# EAGLE design BUZZI-25 (EAGLE 4.15)
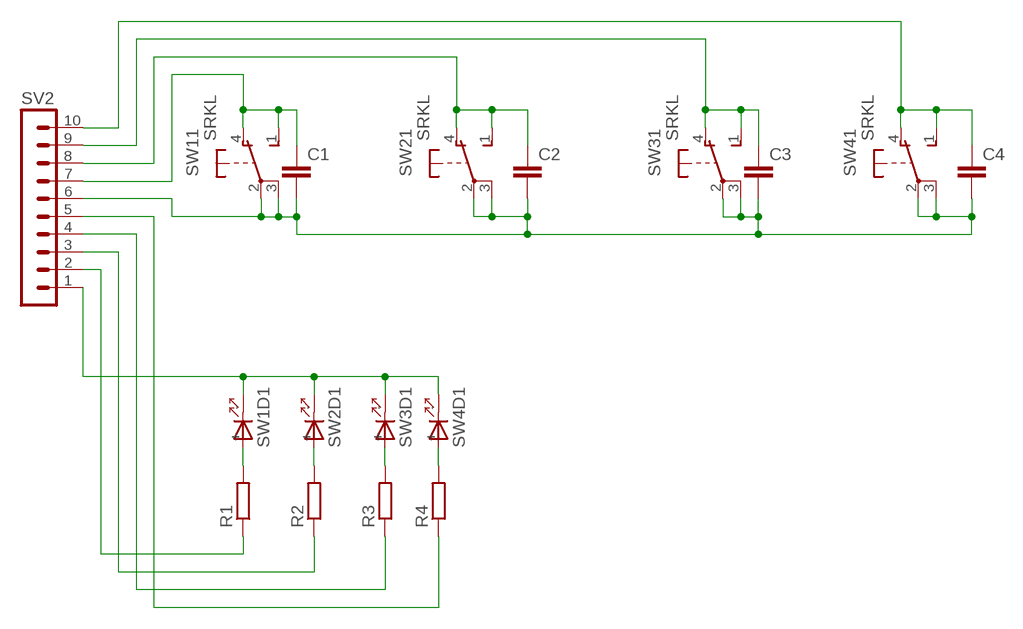
[diagram p0: schematic, sheet 1]

## Parts
C1  C-EUC0805  [C0805]
C2  C-EUC0805  [C0805]
C3  C-EUC0805  [C0805]
C4  C-EUC0805  [C0805]
R1  R-EU_M0805  [M0805]
R2  R-EU_M0805  [M0805]
R3  R-EU_M0805  [M0805]
R4  R-EU_M0805  [M0805]
SV2  MA10-1  [MA10-1]
SW1  SRKL  [SRKL]
SW2  SRKL  [SRKL]
SW3  SRKL  [SRKL]
SW4  SRKL  [SRKL]

## Nets
N$1: R1.2 SW1.+(D1:A)
N$2: R2.2 SW2.+(D1:A)
N$3: R3.2 SW3.+(D1:A)
N$4: R4.2 SW4.+(D1:A)
N$5: SV2.1 SW1.-(D1:C) SW2.-(D1:C) SW3.-(D1:C) SW4.-(D1:C)
N$6: R1.1 SV2.2
N$7: R2.1 SV2.3
N$8: R3.1 SV2.4
N$9: R4.1 SV2.5
N$10: C1.1 SV2.7 SW1.1(1:S) SW1.4(1:O)
N$11: C1.2 C2.2 C3.2 C4.2 SV2.6 SW1.2(1:P) SW1.3(1:P) SW2.2(1:P) SW2.3(1:P) SW3.2(1:P) SW3.3(1:P) SW4.2(1:P) SW4.3(1:P)
N$12: C2.1 SV2.8 SW2.1(1:S) SW2.4(1:O)
N$14: C3.1 SV2.9 SW3.1(1:S) SW3.4(1:O)
N$16: C4.1 SV2.10 SW4.1(1:S) SW4.4(1:O)

## Library data of the parts
C1-C4 = rcl:C-EU: CAPACITOR, European symbol
R1-R4 = rcl:R-EU_: RESISTOR, European symbol
SV2 = con-lstb:MA10-1: PIN HEADER
SW1-SW4 = switch-misc:SRKL: SWITCH

## Board
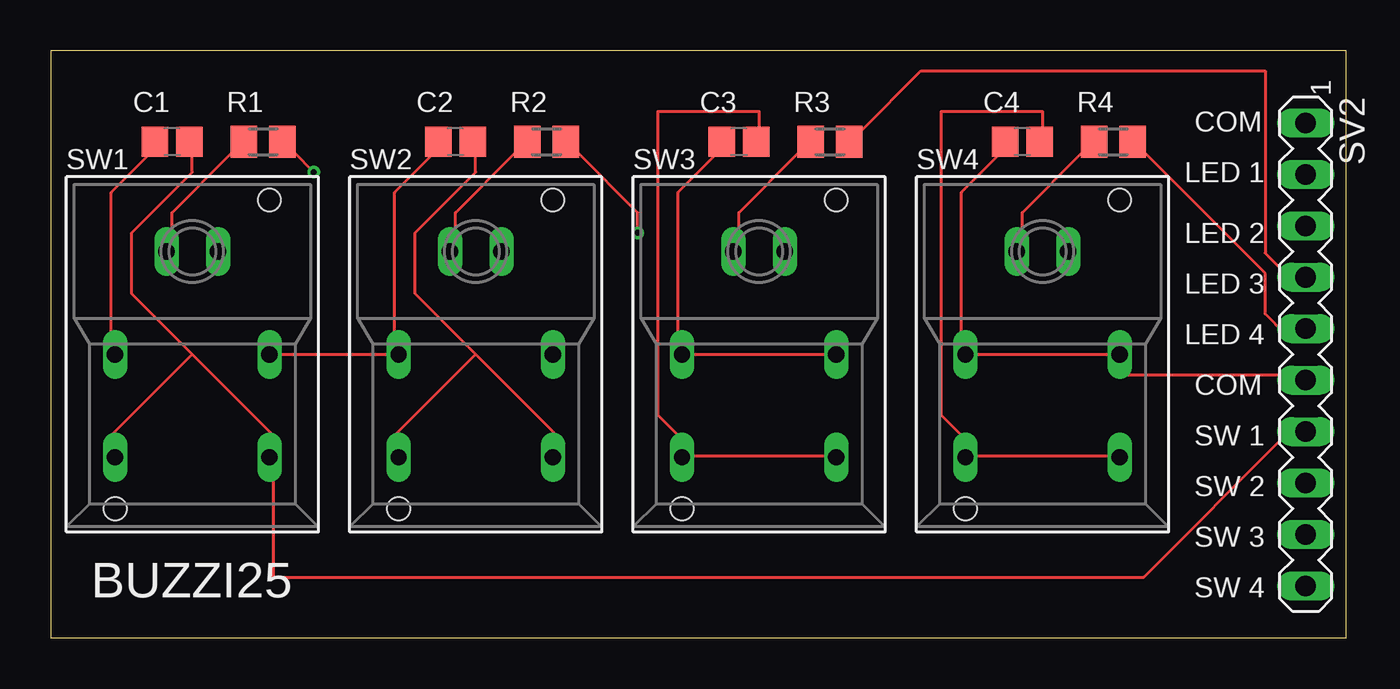
[diagram p1: board, top side]
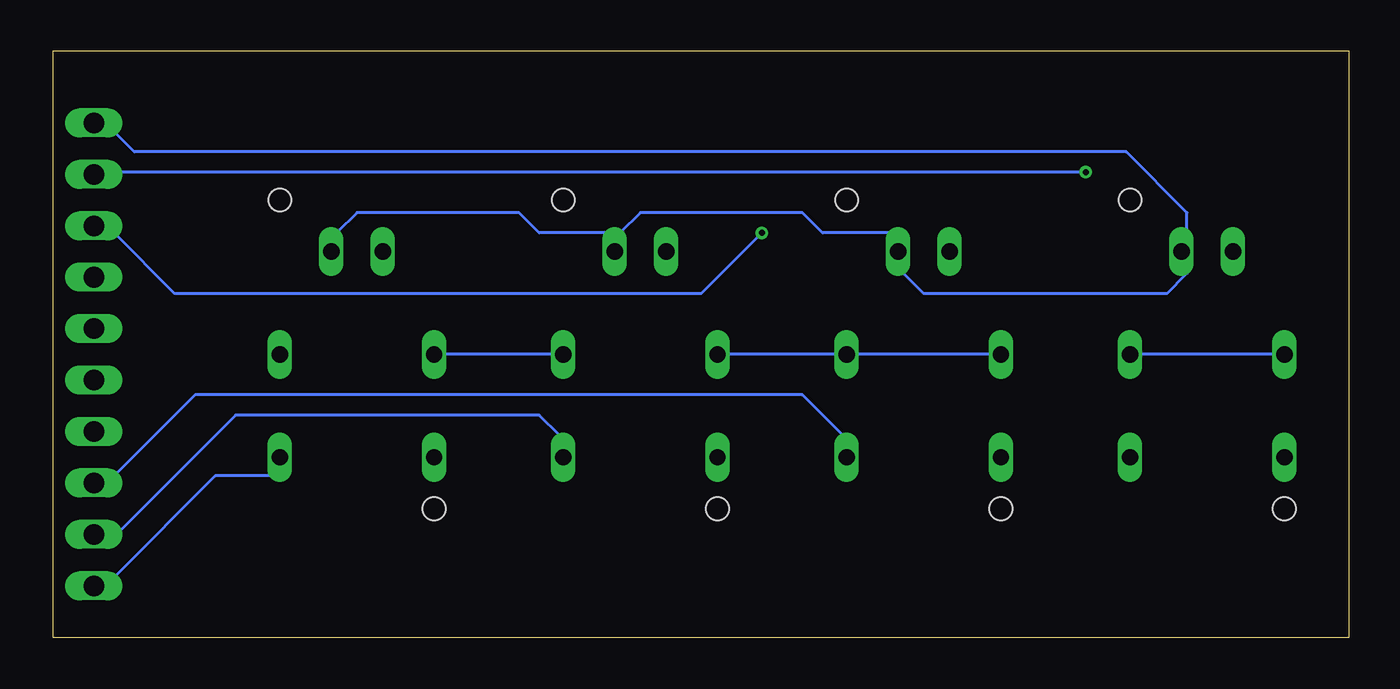
[diagram p2: board, bottom side, seen from below]

Size 64 x 29 mm. Coordinates in mm from the lower left corner, seen from the top.
Outline: 0,0 64,0 64,29 0,29 0,0
Copper layers (1*16): Top 0.035mm / dielectric 1.5mm / Bottom 0.035mm
Design rules "PCB-POOL": minimum track width 6mil, minimum drill 12mil, track to track 6mil, track to pad 6mil, pad to pad 6mil, via to via 6mil, smd to smd 6mil, copper to edge 20mil, drill to drill 8mil, minimum pad ring 8mil, minimum via ring 6mil, stop-mask expansion 3mil, vias tented up to drill 0mil, thermal gap 8mil

### Footprints (pad centres in the part's own frame; a part is rotated, then mirrored left to right if it is on the bottom)
C0805 = smd 1.3 x 1.5: 1 -0.85,0; 2 0.85,0
M0805 = smd 1.3 x 1.6: 1 -0.95,0; 2 0.95,0
MA10-1 = drill 1.016 long: 1 -11.43,0; 2 -8.89,0; 3 -6.35,0; 4 -3.81,0; 5 -1.27,0; 6 1.27,0; 7 3.81,0; 8 6.35,0; 9 8.89,0; 10 11.43,0
SRKL = drill 0.813 long: 1 -3.81,-5.08; 2 -3.81,0; 3 3.81,0; 4 3.81,-5.08; + -1.27,5.08; - 1.27,5.08 | hole 1.118: 3.81,7.62; -3.81,-7.62

### Placement (x,y rotation side)
C1  6,24.5 180 top
C2  20,24.5 180 top
C3  34,24.5 180 top
C4  48,24.5 180 top
R1  10.5,24.5 180 top
R2  24.5,24.5 180 top
R3  38.5,24.5 180 top
R4  52.5,24.5 180 top
SV2  62,14 270 top
SW1  7,14 0 top
SW2  21,14 0 top
SW3  35,14 0 top
SW4  49,14 0 top

### Tracks (layer width: path | path; a pad name or v marks a point on that pad's centre or on a via)
N$1
  Top 0.152: R1.2 9,24 6,21 6,20 SW1.+
N$2
  Top 0.152: R2.2 23,24 20,21 20,20 SW2.+
N$3
  Top 0.152: R3.2 37,24 34,21 34,20 SW3.+
N$4
  Top 0.152: R4.2 51,24 48,21 48,20 SW4.+
N$5
  Bottom 0.152: 36,20 35,21 27,21 26,20 22,20 SW2.- 22,18 21,17 9,17 8,18 SW1.- 8,20 8,21 11,24 60,24 61,25 SV2.1 | 36,20 40,20 41,21 49,21 50,20 SW4.- | 36,20 SW3.-
N$6  (via drill 0.3)
  Top 0.152: v13,23 12,24 R1.1
  Bottom 0.152: v13,23 61,23 SV2.2
N$7  (via drill 0.3)
  Top 0.152: v29,20 29,21 26,24 R2.1
  Bottom 0.152: v29,20 32,17 58,17 61,20 SV2.3
N$8
  Top 0.152: R3.1 40,25 43,28 60,28 60,19 61,18 SV2.4
N$9
  Top 0.152: R4.1 54,24 60,18 60,16 61,15 SV2.5
N$10
  Top 0.152: 7,14 11,10 SW1.4 11,8 11,3 54,3 61,10 SV2.7 | 7,14 4,17 4,20 7,23 7,24 C1.1 | 7,14 3,10 SW1.1
N$11
  Top 0.152: C4.2 47,24 45,22 45,15 SW4.2 | SW4.2 SW4.3 | SW4.3 53,14 | SW4.2 45,14 | SV2.6 61,13 53,13 SW4.3 | C3.2 33,24 31,22 31,15 SW3.2 | C1.2 5,24 3,22 3,15 SW1.2 | C2.2 19,24 17,22 17,15 SW2.2 SW1.3 | SW3.2 SW3.3 39,14 | SW3.2 31,14
  Bottom 0.152: SW3.3 SW4.2 | SW3.2 25,14 SW2.3 SW2.2 17,14 | 3,14 SW1.2 SW1.3 11,14
N$12
  Top 0.152: 21,14 25,10 SW2.4 | 21,14 18,17 18,20 21,23 21,24 C2.1 | 21,14 17,10 SW2.1
  Bottom 0.152: SV2.8 61,8 57,12 27,12 25,10 SW2.4
N$14
  Top 0.152: C3.1 35,25 35,26 30,26 30,11 31,10 SW3.1 31,9 39,9 SW3.4
  Bottom 0.152: SV2.9 61,5 55,11 40,11 39,10 SW3.4
N$16
  Top 0.152: C4.1 49,25 49,26 44,26 44,11 45,10 SW4.1 45,9 53,9 SW4.4
  Bottom 0.152: SV2.10 61,3 56,8 53,8 SW4.4

### Text on the board
tNames: COM | LED 1 | LED 2 | LED 3 | LED 4 | COM | SW 1 | SW 2 | SW 3 | BUZZI25 | SW 4